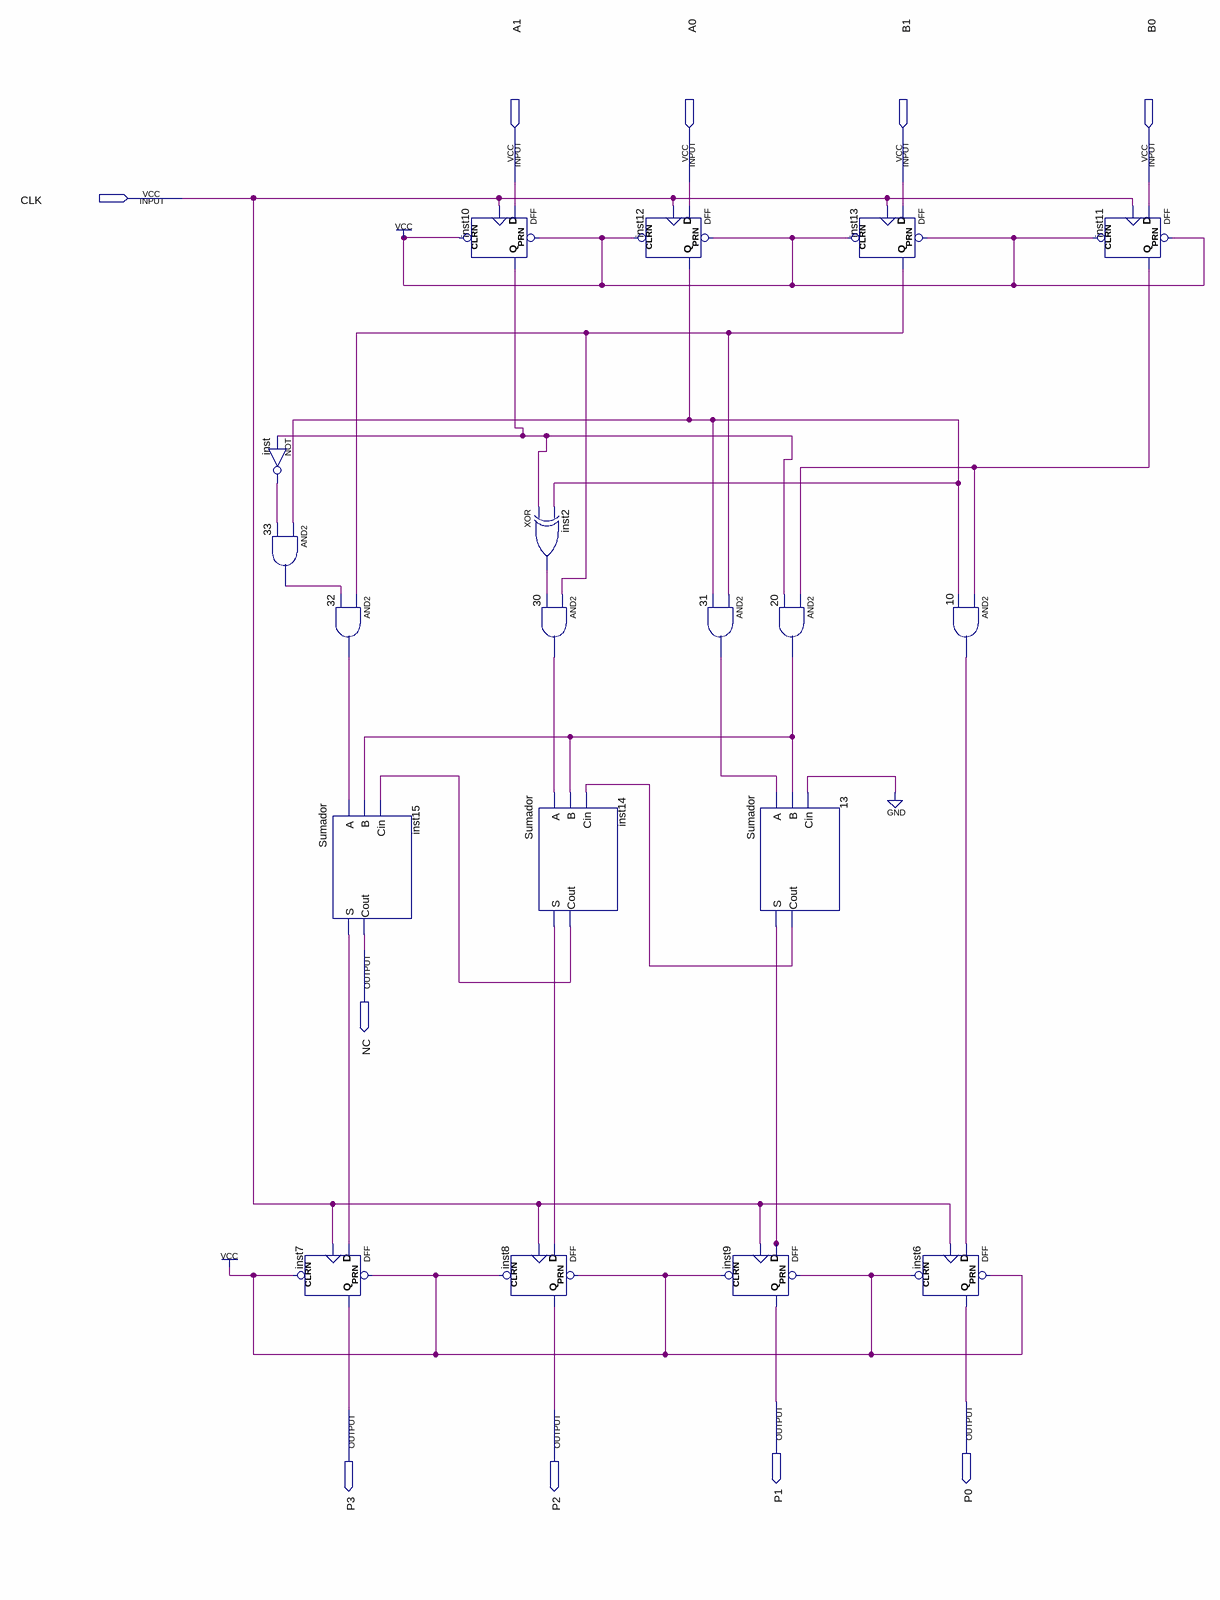
[diagram p0: schematic sheet]
// Quartus schematic Multiplicador_con_signo_Block.bdf as structural Verilog: 19 symbols, 10 pins
module Multiplicador_con_signo_Block (
  input  A1,
  input  A0,
  input  B1,
  input  B0,
  input  CLK,
  output NC,
  output P1,
  output P0,
  output P3,
  output P2
);

  wire inst2_out, inst10_q, inst11_q, inst12_q, inst13_q, inst14_cout, inst14_s, inst15_s, inst_out, n10_out,
       n13_cout, n13_s, n20_out, n30_out, n31_out, n32_out, n33_out;

  not inst (inst_out, inst10_q);
  and u_33 (n33_out, inst12_q, inst_out);
  and u_32 (n32_out, inst13_q, n33_out);
  Sumador inst15 (.A(n32_out), .B(n20_out), .Cin(inst14_cout), .S(inst15_s), .Cout(NC));
  DFF inst7 (.CLRN(1'b1), .CLK(CLK), .D(inst15_s), .PRN(1'b1), .Q(P3));
  DFF inst10 (.CLRN(1'b1), .CLK(CLK), .D(A1), .PRN(1'b1), .Q(inst10_q));
  xor inst2 (inst2_out, inst10_q, inst12_q);
  and u_30 (n30_out, inst13_q, inst2_out);
  Sumador inst14 (.A(n30_out), .B(n20_out), .Cin(n13_cout), .S(inst14_s), .Cout(inst14_cout));
  DFF inst8 (.CLRN(1'b1), .CLK(CLK), .D(inst14_s), .PRN(1'b1), .Q(P2));
  DFF inst12 (.CLRN(1'b1), .CLK(CLK), .D(A0), .PRN(1'b1), .Q(inst12_q));
  and u_31 (n31_out, inst13_q, inst12_q);
  DFF inst9 (.CLRN(1'b1), .CLK(CLK), .D(n13_s), .PRN(1'b1), .Q(P1));
  and u_20 (n20_out, inst11_q, inst10_q);
  Sumador u_13 (.A(n31_out), .B(n20_out), .Cin(1'b0), .S(n13_s), .Cout(n13_cout));
  DFF inst13 (.CLRN(1'b1), .CLK(CLK), .D(B1), .PRN(1'b1), .Q(inst13_q));
  DFF inst6 (.CLRN(1'b1), .CLK(CLK), .D(n10_out), .PRN(1'b1), .Q(P0));
  and u_10 (n10_out, inst11_q, inst12_q);
  DFF inst11 (.CLRN(1'b1), .CLK(CLK), .D(B0), .PRN(1'b1), .Q(inst11_q));
endmodule
